# Altium schematic sheet QSFP.SchDoc
size A4
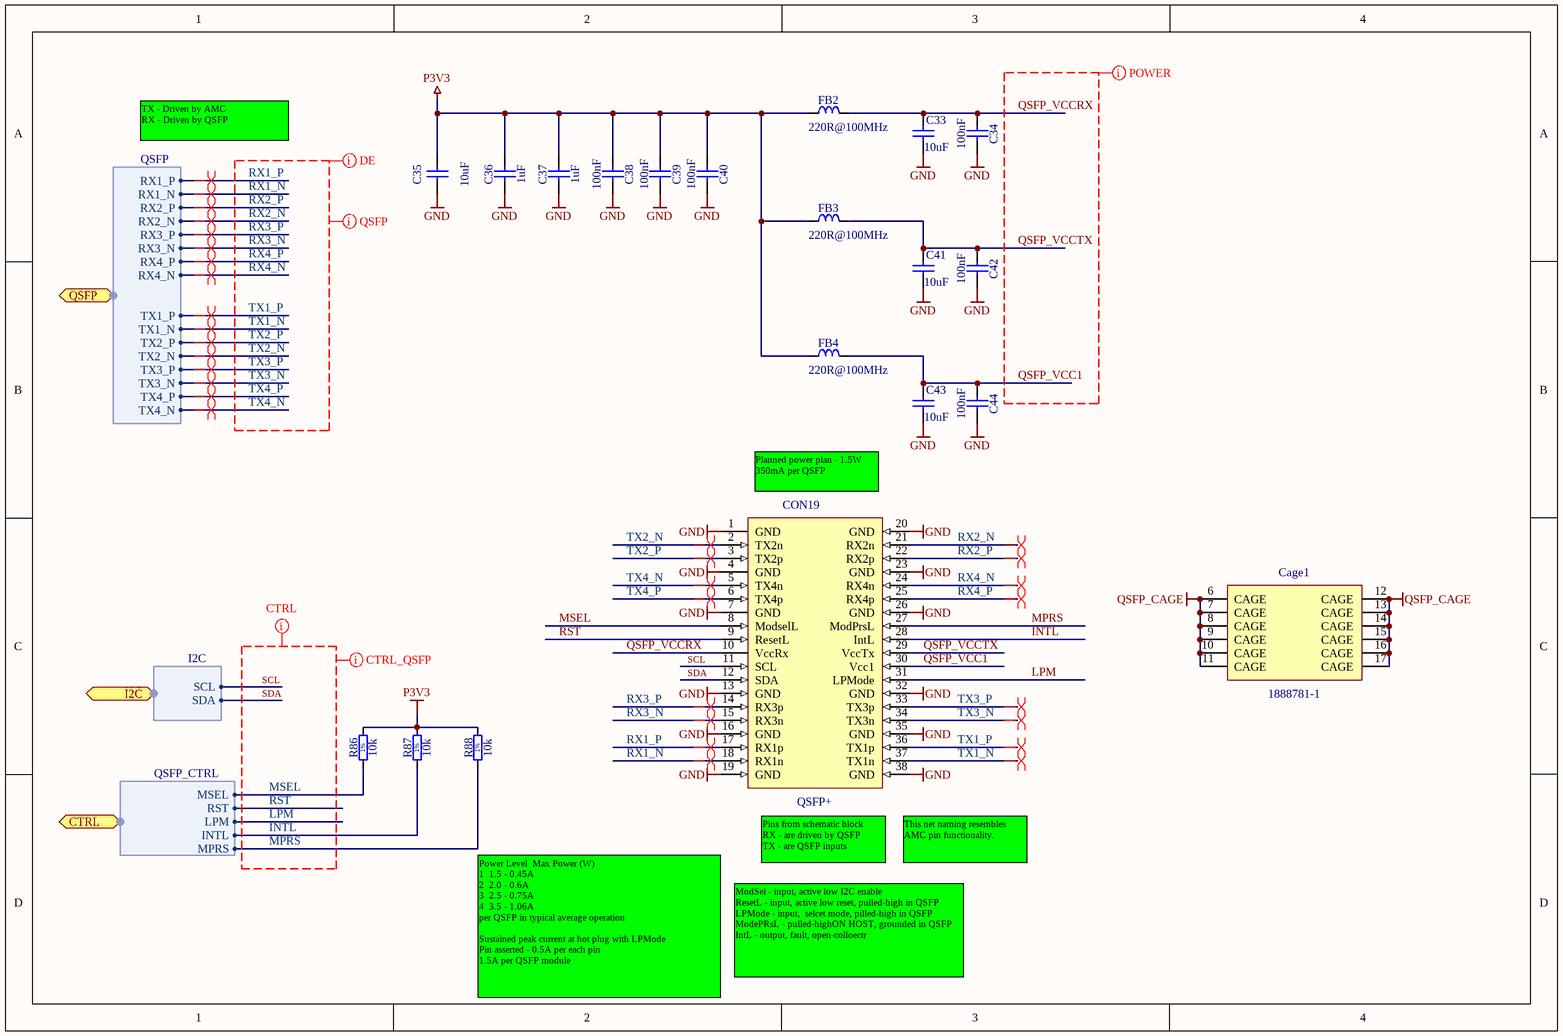
[diagram p0: QSFP.SchDoc]

## Parts
C33  10uF  [CAPC2012X135N]
C34  100nF  [CAPC0603X33N]
C35  10uF  [CAPC2012X135N]
C36  1uF  [CAPC1608X87N]
C37  1uF  [CAPC1608X87N]
C38  100nF  [CAPC0603X33N]
C39  100nF  [CAPC0603X33N]
C40  100nF  [CAPC0603X33N]
C41  10uF  [CAPC2012X135N]
C42  100nF  [CAPC0603X33N]
C43  10uF  [CAPC2012X135N]
C44  100nF  [CAPC0603X33N]
Cage1  1888781-1  [TYCO_1888617-1]
CON19  QSFP+  [TYCO_1761987-9]
FB2  220R@100MHz  [INDC2012X105N]
FB3  220R@100MHz  [INDC2012X105N]
FB4  220R@100MHz  [INDC2012X105N]
R86  10k  [RESC1005X40N]
R87  10k  [RESC1005X40N]
R88  10k  [RESC1005X40N]

## Ports
CTRL (harness QSFP_CTRL), I2C (harness I2C), QSFP (harness QSFP)

## Harnesses
I2C: SCL, SDA
QSFP: RX1_P, RX1_N, RX2_N, RX2_P, TX1_P, TX1_N, TX2_N, TX2_P, RX3_P, RX3_N, RX4_N, RX4_P, TX3_P, TX3_N, TX4_N, TX4_P
QSFP_CTRL: RST, MPRS, MSEL, LPM, INTL

## Nets
GND: C33.2 C34.2 C35.2 C36.1 C37.1 C38.2 C39.2 C40.2 C41.2 C42.2 C43.2 C44.2 CON19.1(GND) CON19.4(GND) CON19.7(GND) CON19.13(GND) CON19.16(GND) CON19.19(GND) CON19.20(GND) CON19.23(GND) CON19.26(GND) CON19.32(GND) CON19.35(GND) CON19.38(GND)
P3V3: C35.1 C36.2 C37.2 C38.1 C39.1 C40.1 FB2.1 FB3.1 FB4.1 R86.2 R87.2 R88.2
QSFP_CAGE: Cage1.6(CAGE) Cage1.7(CAGE) Cage1.8(CAGE) Cage1.9(CAGE) Cage1.10(CAGE) Cage1.11(CAGE) Cage1.12(CAGE) Cage1.13(CAGE) Cage1.14(CAGE) Cage1.15(CAGE) Cage1.16(CAGE) Cage1.17(CAGE)
INTL: CON19.28(IntL) R87.1 ; port CTRL.INTL
LPM: CON19.31(LPMode) ; port CTRL.LPM
MPRS: CON19.27(ModPrsL) R88.1 ; port CTRL.MPRS
MSEL: CON19.8(ModselL) R86.1 ; port CTRL.MSEL
QSFP_VCC1: C43.1 C44.1 CON19.30(Vcc1) FB4.2
QSFP_VCCRX: C33.1 C34.1 CON19.10(VccRx) FB2.2
QSFP_VCCTX: C41.1 C42.1 CON19.29(VccTx) FB3.2
RST: CON19.9(ResetL) ; port CTRL.RST
RX1_N: CON19.18(RX1n) ; port QSFP.RX1_N
RX1_P: CON19.17(RX1p) ; port QSFP.RX1_P
RX2_N: CON19.21(RX2n) ; port QSFP.RX2_N
RX2_P: CON19.22(RX2p) ; port QSFP.RX2_P
RX3_N: CON19.15(RX3n) ; port QSFP.RX3_N
RX3_P: CON19.14(RX3p) ; port QSFP.RX3_P
RX4_N: CON19.24(RX4n) ; port QSFP.RX4_N
RX4_P: CON19.25(RX4p) ; port QSFP.RX4_P
SCL: CON19.11(SCL) ; port I2C.SCL
SDA: CON19.12(SDA) ; port I2C.SDA
TX1_N: CON19.37(TX1n) ; port QSFP.TX1_N
TX1_P: CON19.36(TX1p) ; port QSFP.TX1_P
TX2_N: CON19.2(TX2n) ; port QSFP.TX2_N
TX2_P: CON19.3(TX2p) ; port QSFP.TX2_P
TX3_N: CON19.34(TX3n) ; port QSFP.TX3_N
TX3_P: CON19.33(TX3p) ; port QSFP.TX3_P
TX4_N: CON19.5(TX4n) ; port QSFP.TX4_N
TX4_P: CON19.6(TX4p) ; port QSFP.TX4_P

## Layout directives
differential pair: RX1_N, RX1_P, RX2_N, RX2_P, RX3_N, RX3_P, RX4_N, RX4_P, TX1_N, TX1_P, TX2_N, TX2_P, TX3_N, TX3_P, TX4_N, TX4_P
net class POWER: QSFP_VCC1, QSFP_VCCRX, QSFP_VCCTX
net class QSFP: RX1_N, RX1_P, RX2_N, RX2_P, RX3_N, RX3_P, RX4_N, RX4_P, TX1_N, TX1_P, TX2_N, TX2_P, TX3_N, TX3_P, TX4_N, TX4_P
net class DE: RX1_N, RX1_P, RX2_N, RX2_P, RX3_N, RX3_P, RX4_N, RX4_P, TX1_N, TX1_P, TX2_N, TX2_P, TX3_N, TX3_P, TX4_N, TX4_P
net class CTRL: INTL, LPM, MPRS, MSEL, RST, SCL, SDA
net class CTRL_QSFP: INTL, LPM, MPRS, MSEL, RST, SCL, SDA

## Notes on the sheet
- TX - Driven by AMC
  RX - Driven by QSFP
- Planned power plan - 1.5W
  350mA per QSFP
- (near CON19) Pins from schematic block
  RX - are driven by QSFP
  TX - are QSFP inputs
- (near CON19) This net naming resembles AMC pin functionality.
- ModSel - input, active low I2C enable
  ResetL - input, active low reset, pulled-high in QSFP
  LPMode - input,  selcet mode, pilled-high in QSFP
  ModePRsL - pulled-highON HOST, grounded in QSFP
  IntL - output, fault, open-colloectr
- Power Level  Max Power (W)
  1  1.5 - 0.45A
  2  2.0 - 0.6A
  3  2.5 - 0.75A
  4  3.5 - 1.06A
  per QSFP in typical average operation
  Sustained peak current at hot plug with LPMode
  Pin asserted - 0.5A per each pin
  1.5A per QSFP module
- (in symbol R0402_10K_1%_0.0625W_100PPM) 1%

## Library data of the parts
C33 C35 C41 C43 = CC0805_10UF_10V_10%_X7R: Non-polarised capacitor; Part Description: SMD Multilayer Chip Ceramic Capacitor; Manufacturer: GENERIC; Manufacturer1 Part Number: GRM21BR71A106KE51L; Voltage: 10V; TC: X7R; Tolerance: ±10%; Table: Capacitors SMD; Part Number: CC0805_10UF_10V_10%_X7R; Component Kind: Standard; Component Type: Standard; Pin Count: 2; Value: 10uF; Status: Preferred; Manufacturer Part Number: CC0805_10UF_10V_10%_X7R; Case: 0805; Mounted: Yes; Socket: No; SMD: Yes; Manufacturer1 Example: MURATA; Manufacturer1 ComponentHeight: 1.35mm; HelpURL: \\cern.ch\dfs\Applications\Altium\Datasheets\CC0805_X7R_MURATA.pdf; Author: CERN DEM JLC; CreateDate: 2012-04-30; LatestRevisionDate: 2012-04-30
C34 C38-C40 C42 C44 = CC0201_100NF_6.3V_10%_X5R: Non-polarised capacitor; Part Description: SMD Multilayer Chip Ceramic Capacitor; Manufacturer: GENERIC; Manufacturer1 Part Number: 02016D104KAT2A; Voltage: 6.3V; TC: X5R; Tolerance: ±10%; Table: Capacitors SMD; Part Number: CC0201_100NF_6.3V_10%_X5R; Component Kind: Standard; Component Type: Standard; Pin Count: 2; Value: 100nF; Status: Not Recommended; Manufacturer Part Number: CC0201_100NF_6.3V_10%_X5R; Case: 0201; Mounted: Yes; Socket: No; SMD: Yes; Manufacturer1 Example: AVX; Manufacturer1 ComponentHeight: 0.33mm; HelpURL: \\cern.ch\dfs\Applications\Altium\Datasheets\CC0201_X5R_AVX.pdf; Author: CERN DEM JLC; CreateDate: 2007-12-03; LatestRevisionDate: 2007-12-03
C36 C37 = CC0603_1UF_25V_10%_X7R: Non-polarised capacitor; Part Description: SMD Multilayer Chip Ceramic Capacitor; Manufacturer: GENERIC; Manufacturer1 Part Number: GRM188R71E105KA12D; Voltage: 25V; TC: X7R; Tolerance: ±10%; Table: Capacitors SMD; Part Number: CC0603_1UF_25V_10%_X7R; Component Kind: Standard; Component Type: Standard; Pin Count: 2; Value: 1uF; Status: None; Manufacturer Part Number: CC0603_1UF_25V_10%_X7R; Case: 0603; Mounted: Yes; Socket: No; SMD: Yes; Manufacturer1 Example: MURATA; Manufacturer1 ComponentHeight: 0.9mm; HelpURL: \\cern.ch\dfs\Applications\Altium\Datasheets\CC0603_X7R_MURATA.pdf; Author: CERN DEM JLC; CreateDate: 2011-01-18; LatestRevisionDate: 2011-01-18
Cage1 = CON_QSFP+_cage: QSFP+ 1x3 Cage (23Pins); Part Number: TYCO_2007456-1; Part Description: 1x3 Press Fit Cage+ Heat Sink For Use with QSFP+ Connector (Quad Small Form-factor Pluggable); Manufacturer: TYCO ELECTRONICS; Manufacturer Part Number: 2007456-1; Table: TYCO; Component Kind: Standard; Component Type: Standard; Footprint: TYCO_2007456-1; Pin Count: 23; Family: QSFP+; Mounted: Yes; Socket: No; SMD: No; Status: None; ComponentHeight: 13.2mm; HelpURL: \\cern.ch\dfs\Applications\Altium\Datasheets\TYCO_2007456-1.pdf; Author: CERN DEM JLC; CreateDate: 2013-07-15; LatestRevisionDate: 2013-07-15
CON19 = TYCO_1761987-9: 38Position QSFP Connector  (Quad Small Form-factor Pluggable); Part Description: Surface Mount EVERCLEAR Mini-SAS Right Angle QSFP Host Connector; Manufacturer: TYCO ELECTRONICS; Table: TYCO; Part Number: TYCO_1761987-9; Component Kind: Standard; Component Type: Standard; Pin Count: 38; Family: QSFP+; Mounted: Yes; Socket: No; SMD: No; Status: None; Manufacturer Part Number: 1761987-9; ComponentHeight: 5.55mm; HelpURL: \\cern.ch\dfs\Applications\Altium\Datasheets\TYCO_1761987-9.pdf; Author: CERN DEM JLC; CreateDate: 2013-07-15; LatestRevisionDate: 2013-07-15
FB2-FB4 = IND0805_MURATA_BLM21PG221SN1D: Inductor; Part Description: SMD EMIFIL Suppression Chip Ferrite Bead; Manufacturer: MURATA; Power: 2A; Resistance: 0.05R; Tolerance: ±25%; Table: Inductors SMD; Part Number: IND0805_MURATA_BLM21PG221SN1D; Component Kind: Standard; Component Type: Standard; Pin Count: 2; Value: 220R@100MHz; Status: None; Manufacturer Part Number: BLM21PG221SN1D; Case: 0805; Mounted: Yes; Socket: No; SMD: Yes; ComponentHeight: 1.05mm; HelpURL: \\cern.ch\dfs\Applications\Altium\Datasheets\IND0402_MURATA_BLM21P.pdf; Author: CERN DEM JLC; CreateDate: 2010-01-25; LatestRevisionDate: 2010-01-25
R86-R88 = R0402_10K_1%_0.0625W_100PPM: Resistor - 1%; Part Description: General Purpose Thick Film Chip Resistor; Manufacturer: GENERIC; Manufacturer1 Part Number: 232270671003L; TC: ±100ppm/°C; Table: Resistors SMD; Part Number: R0402_10K_1%_0.0625W_100PPM; Component Kind: Standard; Component Type: Standard; Pin Count: 2; Value: 10k; Status: Not recommended; Power: 0.0625W; Tolerance: ±1%; Manufacturer Part Number: R0402_10K_1%_0.0625W_100PPM; Case: 0402; Mounted: Yes; Socket: No; SMD: Yes; Manufacturer1 Example: YAGEO PHYCOMP; Manufacturer1 ComponentHeight: 0.4mm; HelpURL: \\cern.ch\dfs\Applications\Altium\Datasheets\R0402_Phycomp_RC0402.pdf; Author: CERN DEM JLC; CreateDate: 2007-12-03; LatestRevisionDate: 2012-10-17